# EasyEDA Pro project 25工创PCB.eprj, board 功率板PCB
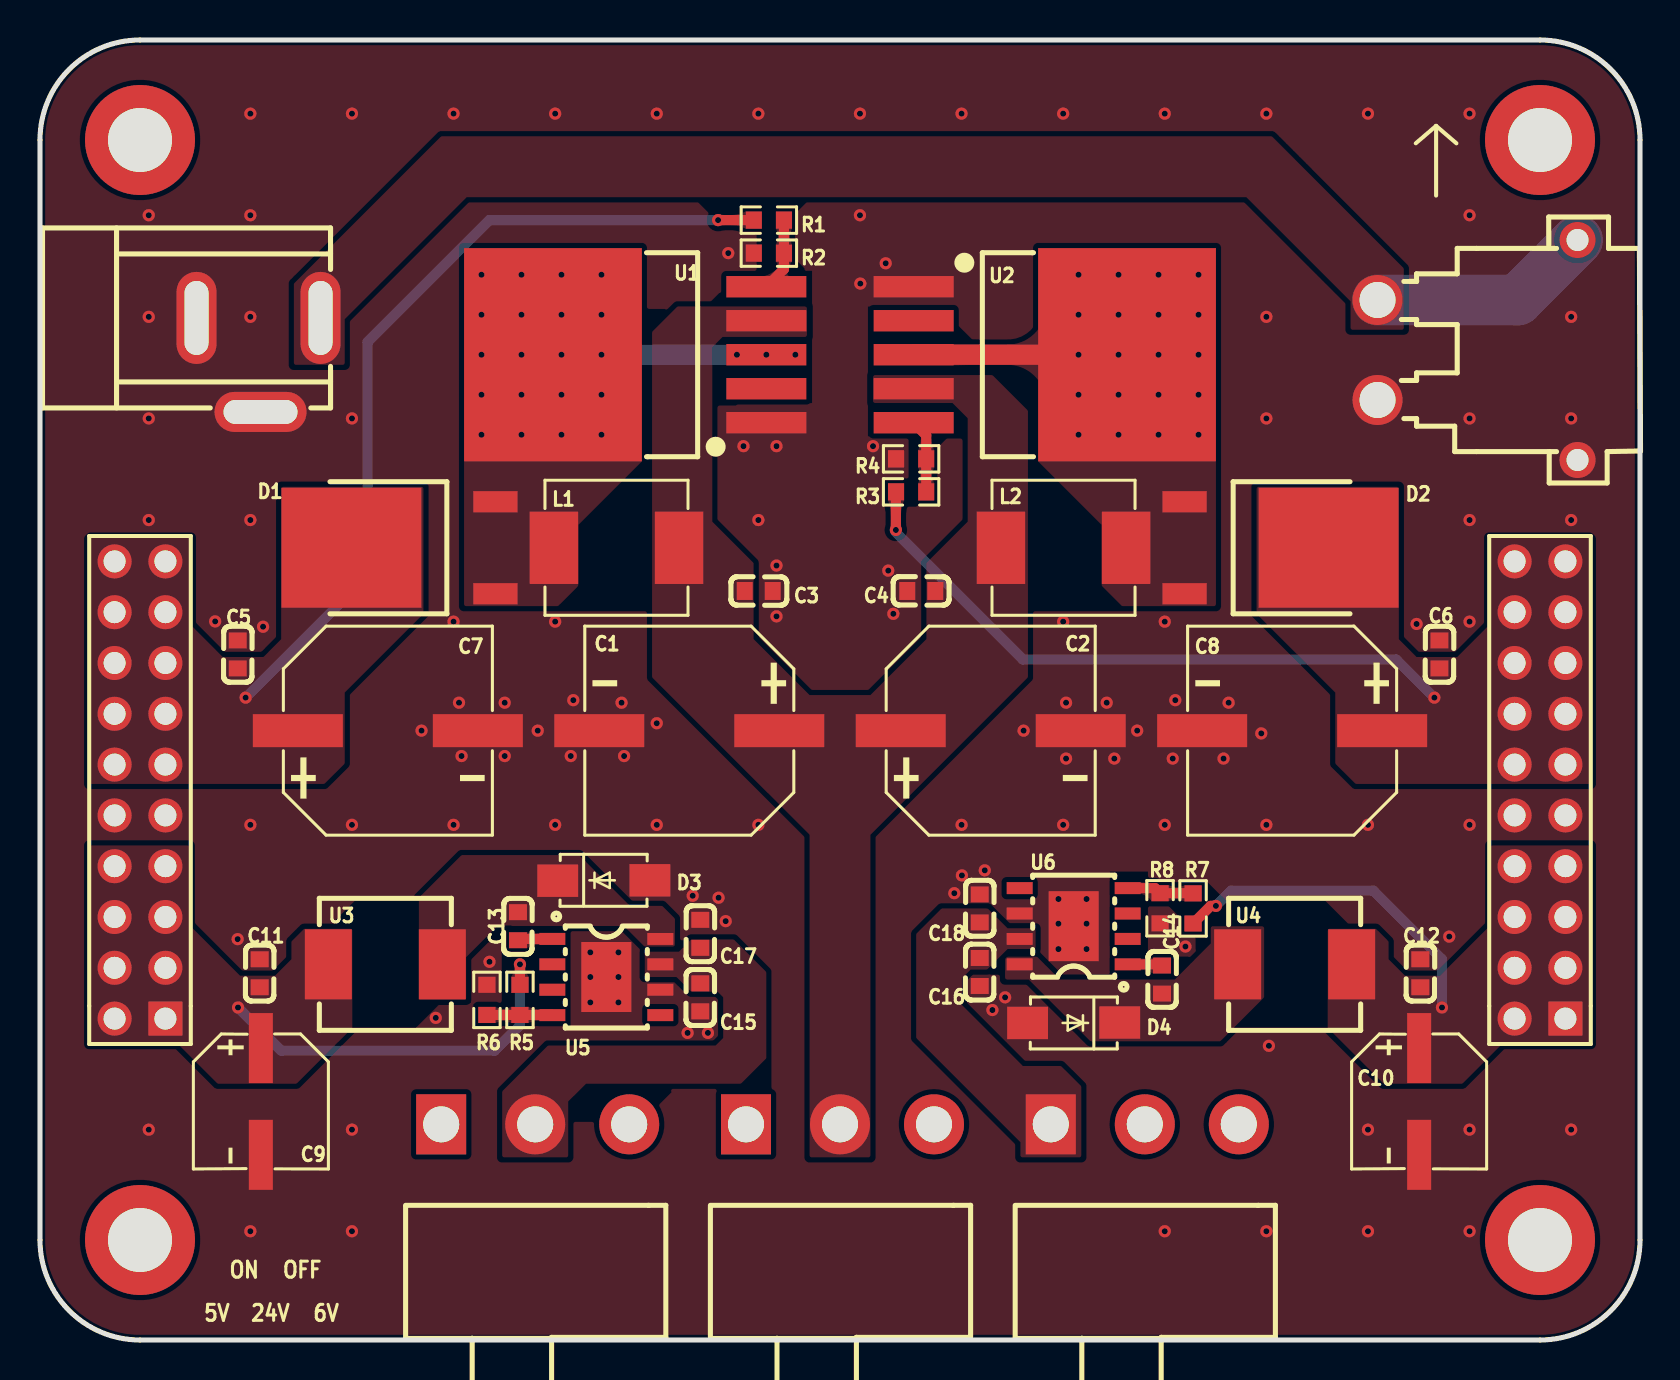
[diagram p8: board, top side]
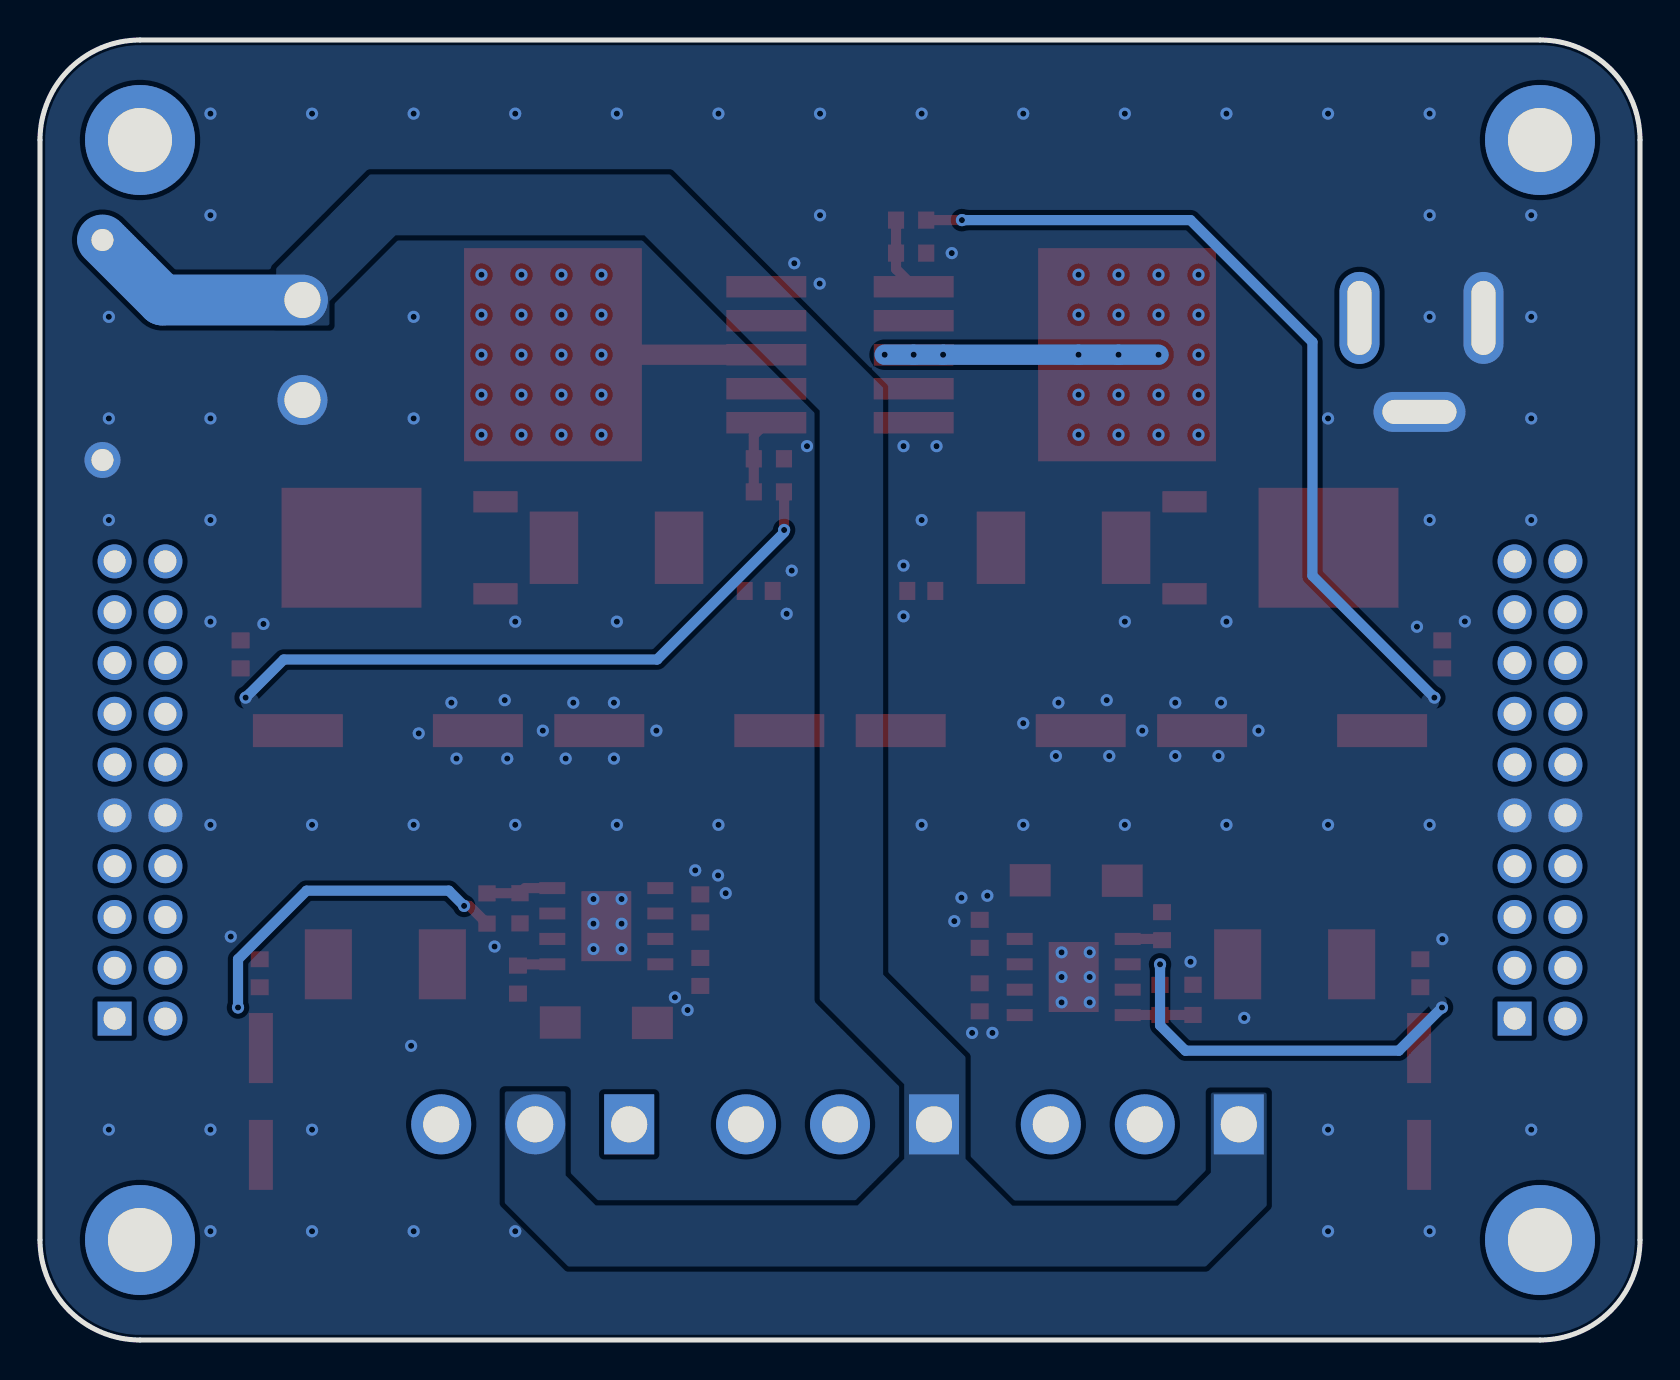
[diagram p9: board, bottom side, seen from below]

Outline 80 x 65 mm; copper layers: Top Layer, Bottom Layer. Coordinates in mm from the lower left corner of the outline.
Outline path: 0,60 0,5 arc(1.46,1.46) 5,0 75,0 arc(78.54,1.46) 80,5 80,60 arc(78.54,63.54) 75,65 5,65 arc(1.46,63.54) 0,60
Stack: Top Layer 0.035mm / Dielectric1 1.51mm FR4 er 4.5 / Bottom Layer 0.035mm

## Design rules (mm)
template: 自定义配置
spacing copperThickness1oz (default): track to track 0.102, other pairs 0.152 to 0.3
spacing copperThickness2oz: track to track 0.203, other pairs 0.152 to 0.3
track width copperThickness1oz (default): min 0.127, default 0.254, max 2.54
track width copperThickness2oz: min 0.203, default 0.254, max 2.54
differential pair differentialPair (default): width min 0.127, default 0.254, max 2.54; gap min 0.152, default 0.152
via viaSize (default): diameter min 0.5, default 0.61, max 10; hole min 0.3, default 0.305, max 6.3

## Placement (name value [footprint] x y rotation side)
C1  680uF  [CAP-SMD_BD10.0-L10.3-W10.3-LS11.3-FD]  32.46 30.47 180 top
C2  680uF  [CAP-SMD_BD10.0-L10.3-W10.3-LS11.3-FD]  47.54 30.47 0 top
C3  1uF  [C0603]  35.94 37.45 180 top
C4  1uF  [C0603]  44.06 37.45 0 top
C5  1uF  [C0603]  9.89 34.28 270 top
C6  1uF  [C0603]  69.97 34.28 270 top
C7  680uF  [CAP-SMD_BD10.0-L10.3-W10.3-LS11.3-FD]  17.39 30.47 0 top
C8  680uF  [CAP-SMD_BD10.0-L10.3-W10.3-LS11.3-FD]  62.61 30.47 180 top
C9  220uF  [CAP-SMD_BD6.3-L6.6-W6.6-FD]  11.04 11.93 270 top
C10  220uF  [CAP-SMD_BD6.3-L6.6-W6.6-FD]  68.96 11.93 270 top
C11  100nF  [C0603]  10.98 18.34 270 top
C12  100nF  [C0603]  69.02 18.34 270 top
C13  10nF  [C0603]  23.9 20.69 90 top
C14  10nF  [C0603]  56.1 18.02 270 top
C15  4.7uF  [C0603]  33.01 17.13 90 top
C16  4.7uF  [C0603]  46.99 18.4 90 top
C17  4.7uF  [C0603]  33.01 20.31 270 top
C18  4.7uF  [C0603]  46.99 21.58 270 top
CN3  XT30PW-M30.G.Y  [CONN-TH_XT30PW-M]  71.88 49.5 90 top
D1  MBRD1045  [TO-252-3_L6.5-W5.9-P4.60-LS10.0-BL]  19.17 39.61 90 top
D2  MBRD1045  [TO-252-3_L6.5-W5.9-P4.60-LS10.0-BL]  60.83 39.61 270 top
D3  SS54  [SMA_L4.3-W2.6-LS5.0-FD]  28.19 22.97 180 top
D4  SS54  [SMA_L4.3-W2.6-LS5.0-FD]  51.68 15.86 0 top
DC2  -  [DC-IN-TH_DC005]  10.93 48.75 0 top
H1  X6521WV-2x10H-C60D30  [HDR-TH_20P-P2.54-V-M-R2-C10-S2.54]  75 27.5 90 top
H2  X6521WV-2x10H-C60D30  [HDR-TH_20P-P2.54-V-M-R2-C10-S2.54]  5 27.5 90 top
L1  47uH  [IND-SMD_L7.0-W6.6_FXL0630]  28.82 39.61 0 top
L2  47uH  [IND-SMD_L7.0-W6.6_FXL0630]  51.18 39.61 180 top
NOREF  -  [Pad_e55]  5 60 0 top
NOREF#2  -  [Pad_e54]  75 60 0 top
NOREF#3  -  [Pad_e57]  75 5 0 top
NOREF#4  -  [Pad_e56]  5 5 0 top
POWER1  SS-12D06L5  [SW-TH_3P-P4.70_L11.1-W12.7]  40 10.78 0 top
POWER2  SS-12D06L5  [SW-TH_3P-P4.70_L11.1-W12.7]  24.76 10.78 0 top
POWER3  SS-12D06L5  [SW-TH_3P-P4.70_L11.1-W12.7]  55.24 10.78 0 top
R1  49.9kΩ  [R0603]  36.44 56 180 top
R2  2.7kΩ  [R0603]  36.44 54.34 0 top
R3  49.9kΩ  [R0603]  43.56 42.41 180 top
R4  2.7kΩ  [R0603]  43.56 44.06 0 top
R5  10KΩ  [R0603]  24 17.01 90 top
R6  3.24KΩ  [R0603]  22.35 17.01 270 top
R7  10KΩ  [R0603]  57.65 21.58 270 top
R8  2.55KΩ  [R0603]  56 21.59 90 top
U1  XL6019E1  [TO-263-5_L10.2-W9.9-P1.70-LS14.4-TL]  30.98 49.26 180 top
U2  XL6019E1  [TO-263-5_L10.2-W9.9-P1.70-LS14.4-TL]  49.02 49.26 0 top
U3  22uH  [IND-SMD_L7.2-W6.6_GPSR07X0]  17.27 18.78 0 top
U4  22uH  [IND-SMD_L7.2-W6.6_GPSR07X0]  62.73 18.78 180 top
U5  TPS5430DDAR  [ESOP-8_L4.9-W3.9-P1.27-LS6.0-TL-EP]  28.32 18.15 0 top
U6  TPS5430DDAR  [ESOP-8_L4.9-W3.9-P1.27-LS6.0-TL-EP]  51.68 20.69 180 top

## Footprints (pads in the part's own frame, mm; a bottom-side part is the same pattern mirrored in y, then rotated)
C0603
  rect 0.8x0.9 smd: 1(-0.7,0) 2(0.7,0)
CAP-SMD_BD6.3-L6.6-W6.6-FD
  rect 3.5x1.2 smd: 1(-2.67,0) 2(2.67,0)
CAP-SMD_BD10.0-L10.3-W10.3-LS11.3-FD
  rect 4.5x1.65 smd: 1(-4.5,0) 2(4.5,0)
CONN-TH_XT30PW-M
  round 2.5 hole 1.8: 1(-2.5,5) 2(2.5,5)
  round 1.8 hole 1.1: 3(5.5,-5) 4(-5.5,-5)
DC-IN-TH_DC005
  oval 2x4.6 hole 1.2x3.7: 1(3.1,2.35) 2(-3.1,2.35)
  oval 4.6x2 hole 3.7x1.2: 3(0.1,-2.35)
ESOP-8_L4.9-W3.9-P1.27-LS6.0-TL-EP
  rect 1.3x0.6 smd: 1(-2.7,1.905) 2(-2.7,0.635) 3(-2.7,-0.635) 4(-2.7,-1.905) 5(2.7,-1.905) 6(2.7,-0.635) 7(2.7,0.635) 8(2.7,1.905)
  rect 2.5x3.5 smd: 9(0,0)
HDR-TH_20P-P2.54-V-M-R2-C10-S2.54
  rect 1.7x1.7 hole 1.1: 1(-11.43,-1.27)
  round 1.7 hole 1.1: 2(-11.43,1.27) 3(-8.89,-1.27) 4(-8.89,1.27) 5(-6.35,-1.27) 6(-6.35,1.27) 7(-3.81,-1.27) 8(-3.81,1.27) 9(-1.27,-1.27) 10(-1.27,1.27) 11(1.27,-1.27) 12(1.27,1.27) 13(3.81,-1.27) 14(3.81,1.27) 15(6.35,-1.27) 16(6.35,1.27) 17(8.89,-1.27) 18(8.89,1.27) 19(11.43,-1.27) 20(11.43,1.27)
IND-SMD_L7.0-W6.6_FXL0630
  rect 2.424x3.62 smd: 1(3.128,0) 2(-3.128,0)
IND-SMD_L7.2-W6.6_GPSR07X0
  rect 2.35x3.5 smd: 1(-2.85,0) 2(2.85,0)
Pad_e54
  round 5.5 hole 3.2: 101(0,0)
Pad_e55
  round 5.5 hole 3.2: 101(0,0)
Pad_e56
  round 5.5 hole 3.2: 101(0,0)
Pad_e57
  round 5.5 hole 3.2: 101(0,0)
R0603
  rect 0.806x0.864 smd: 1(-0.753,0) 2(0.753,0)
SMA_L4.3-W2.6-LS5.0-FD
  rect 2.046x1.62 smd: 1(-2.304,-0.009) 2(2.304,0.009)
SW-TH_3P-P4.70_L11.1-W12.7
  rect 2.5x3 hole 1.8: 1(-4.7,0)
  round 3 hole 1.8: 2(0,0) 3(4.7,0)
TO-252-3_L6.5-W5.9-P4.60-LS10.0-BL
  rect 1.064x2.219 smd: 1(-2.3,-3.599) 3(2.3,-3.599)
  rect 6x7 smd: 2(0,3.599)
TO-263-5_L10.2-W9.9-P1.70-LS14.4-TL
  rect 4x1.069 smd: 1(-5.334,3.4) 2(-5.334,1.7) 3(-5.334,0) 4(-5.334,-1.7) 5(-5.334,-3.4)
  rect 8.89x10.66 smd: 6(5.334,0)

## Nets
As in the schematic.

Pads without a net: NOREF 101; NOREF#2 101; NOREF#3 101; NOREF#4 101; POWER1 3; POWER2 3; POWER3 3; U1 2; U2 2; U5 2 3 5; U6 2 3 5

## Via types
v1: diameter 0.61, hole 0.305, Top Layer to Bottom Layer, 173 vias

## Routing (per net, layer and track width the routed paths; a pad name or vN(x,y) marks a point on that pad's centre or on a via; arc(x,y) is an arc through that point)
24V_1: length 42.1
  Top Layer w0.508: v1(33.9,56) R1.2
  Bottom Layer w0.508: v1(10.28,32.12) 16.38,38.22 16.38,49.9 22.47,56 v1(33.9,56)
24V_2: length 32.3
  Top Layer w0.508: v1(42.79,40.5) 42.79,42.4 R3.2
  Bottom Layer w0.508: 42.79,40.37 49.14,34.02 67.81,34.02 v1(69.72,32.12)
+5V: length 19.6
  Top Layer w0.508: v1(24,18.78) R5.2
  Bottom Layer w0.508: v1(24,18.78) 24,15.74 22.73,14.47 12.06,14.47 v1(9.9,16.62)
+6V: length 17
  Top Layer w0.508: v1(58.8,21.7) 58.53,21.7 R7.2
  Bottom Layer w0.508: v1(58.8,21.7) 59.56,22.47 66.67,22.47 70.1,19.04 v1(70.1,16.62)
GND:
  vias: v1(5.44,56.24) v1(5.44,51.16) v1(5.44,46.08) v1(5.44,41) v1(5.44,10.52) v1(8.76,35.93) v1(9.88,20.04) v1(10.52,61.32) v1(10.52,56.24) v1(10.52,51.16) v1(10.52,41) v1(10.52,25.76) v1(10.52,5.44) v1(11.15,35.66) v1(15.6,61.32) v1(15.6,46.08) v1(15.6,25.76) v1(15.6,10.52) v1(15.6,5.44) v1(19.08,30.47) v1(19.79,16.11) v1(20.68,61.32) v1(20.68,35.92) v1(20.68,25.76) v1(20.95,31.86) v1(21.08,29.2) v1(22.47,18.91) v1(23.24,31.86) v1(23.24,29.2) v1(24.89,30.47) v1(25.76,61.32) v1(25.76,35.92) v1(25.76,25.76) v1(26.54,29.2) v1(26.66,31.99) v1(27.52,19.38) v1(27.52,18.15) v1(27.52,16.88) v1(28.92,19.38) v1(28.92,18.15) v1(28.92,16.88) v1(29.08,31.86) v1(29.21,29.2) v1(30.84,61.32) v1(30.84,30.84) v1(30.84,25.76) v1(32.38,15.36) v1(32.63,22.21) v1(33.4,15.36) v1(33.93,22.11) v1(34.28,20.94) v1(34.41,54.34) v1(35.17,44.69) v1(35.92,61.32) v1(35.92,41) v1(35.92,25.76) v1(36.82,44.69) v1(36.82,38.72) v1(36.82,36.18) v1(41,61.32) v1(41,56.24) v1(41.02,52.82) v1(41.65,44.69) v1(42.29,53.84) v1(42.41,38.47) v1(42.67,36.31) v1(45.72,22.34) v1(46.08,61.32) v1(46.08,25.76) v1(46.1,23.23) v1(47.24,23.48) v1(47.62,16.5) v1(48.25,17.13) v1(49.18,30.47) v1(50.92,22.05) v1(50.92,20.82) v1(50.92,19.55) v1(51.16,61.32) v1(51.16,35.92) v1(51.16,25.76) v1(51.3,31.86) v1(51.3,29.07) v1(52.33,22.05) v1(52.33,20.82) v1(52.33,19.55) v1(53.34,31.86) v1(53.72,29.07) v1(54.86,30.47) v1(56.24,61.32) v1(56.24,35.92) v1(56.24,25.76) v1(56.24,5.44) v1(56.64,29.07) v1(56.76,31.99) v1(57.27,19.67) v1(59.18,29.07) v1(59.43,31.86) v1(61.06,30.33) v1(61.32,61.32) v1(61.32,51.16) v1(61.32,46.08) v1(61.32,25.76) v1(61.32,5.44) v1(61.44,14.71) v1(66.4,61.32) v1(66.4,25.76) v1(66.4,10.52) v1(66.4,5.44) v1(68.83,35.8) v1(70.46,20.17) v1(71.48,61.32) v1(71.48,56.24) v1(71.48,46.08) v1(71.48,41) v1(71.48,35.92) v1(71.48,25.76) v1(71.48,10.52) v1(71.48,5.44) v1(76.56,51.16) v1(76.56,46.08) v1(76.56,41) v1(76.56,10.52)
+POW: length 11.2
  Bottom Layer w2.54: CN3.2 73.88,52 CN3.3
$1N7163: length 13.7
  Bottom Layer w1.016: v1(24.07,49.26) v1(26.07,49.26) v1(28.07,49.26) v1(34.85,49.26) v1(36.32,49.26) v1(37.77,49.26)
  vias: v1(22.07,53.26) v1(22.07,51.26) v1(22.07,49.26) v1(22.07,47.26) v1(22.07,45.26) v1(24.07,53.26) v1(24.07,51.26) v1(24.07,47.26) v1(24.07,45.26) v1(26.07,53.26) v1(26.07,51.26) v1(26.07,47.26) v1(26.07,45.26) v1(28.07,53.26) v1(28.07,51.26) v1(28.07,47.26) v1(28.07,45.26)
$1N7164: length 3.7
  Top Layer w0.508: U1.5 37.2,53.54 R2.2 R1.1
$1N7175: length 3.7
  Top Layer w0.508: R3.1 R4.2 44.31,45.24 U2.5
$1N7176: length 8.2
  Top Layer w1.016: U2.3 v1(51.93,49.26)
  vias: v1(51.93,53.26) v1(51.93,51.26) v1(51.93,47.26) v1(51.93,45.26) v1(53.93,53.26) v1(53.93,51.26) v1(53.93,49.26) v1(53.93,47.26) v1(53.93,45.26) v1(55.93,53.26) v1(55.93,51.26) v1(55.93,49.26) v1(55.93,47.26) v1(55.93,45.26) v1(57.93,53.26) v1(57.93,51.26) v1(57.93,49.26) v1(57.93,47.26) v1(57.93,45.26)
$1N7193: length 3.3
  Top Layer w0.508: U5.4 25.61,16.25 R5.1 R6.2
$1N7197: length 1.7
  Top Layer w0.508: C13.1 23.96,20.05 U5.1
$1N7211: length 3.4
  Top Layer w0.508: U6.4 55.75,22.59 R8.2 57.64,22.34 R7.1
$1N7216: length 1.7
  Top Layer w0.508: C14.1 56.04,18.78 U6.1

## Copper pours and planes (outline as drawn; the poured copper is in the pictures)
24V_1 on Top Layer: 19.17,42.66 19.17,36.31 15.23,32.37 15.23,28.82 14.22,27.8 2.46,27.8 2.46,40.05 2.53,40.12 7.54,40.12 7.54,35.75 9.14,34.15 11.17,34.15 12.06,35.04 12.06,42.66
24V_2 on Top Layer: 60.83,42.66 60.83,36.31 64.76,32.37 64.76,28.82 65.78,27.8 77.54,27.8 77.54,40.05 77.47,40.12 72.46,40.12 72.46,35.75 70.86,34.15 68.83,34.15 67.94,35.04 67.94,42.66
+5V on Top Layer: 15.62,20.56 13.2,20.56 12.57,19.93 12.57,19.04 11.75,18.22 10,18.22 7.49,20.73 7.49,24.72 2.46,24.72 2.46,14.8 6.9,14.8 8.89,12.81 12.82,12.81 15.62,15.61
+6V on Top Layer: 64.38,20.56 66.8,20.56 67.43,19.93 67.43,19.04 68.25,18.22 70,18.22 72.51,20.73 72.51,24.72 77.54,24.72 77.54,14.8 73.1,14.8 71.12,12.81 67.18,12.81 64.38,15.61
GND on Top Layer: -1.78,67.42 81.78,67.42 81.78,-3.31 -1.78,-3.31
GND on Bottom Layer: -5.72,70.85 87.12,70.85 87.12,-7.12 -5.72,-7.12
+POW on Top Layer: 12.69,48.76 12.69,52.82 20.06,60.19 61.59,60.19 68.19,53.58 68.19,50.52 65.53,50.52 65.53,51.93 60.32,57.14 21.33,57.14 15.23,51.04 15.23,48.76
+POW on Bottom Layer: 65.53,51.93 62.22,55.23 49.78,55.23 41.02,46.47 41.02,17.02 36.79,12.79 36.79,9.06 39.12,6.73 52.22,6.73 53.72,8.23 53.72,12.43 56.76,12.43 56.76,6.85 53.59,3.67 21.71,3.67 18.66,6.72 18.66,12.37 21.46,12.37 21.46,8.37 23.11,6.72 31.38,6.72 33.72,9.06 33.72,14.15 37.84,18.27 37.84,47.61 48.51,58.28 63.5,58.28 68.19,53.58 68.19,50.72 65.53,50.72
$1N7163 on Top Layer: 21.2,54.6 21.2,36.69 25.9,36.69 26.92,37.71 26.92,40.75 30.09,43.93 30.09,54.6
$1N7176 on Top Layer: 58.8,54.6 58.8,36.69 54.1,36.69 53.08,37.71 53.08,40.75 49.91,43.93 49.91,54.6
$1N7196 on Top Layer: 30.22,19.67 29.19,20.7 22.87,20.7 21.31,19.14 21.31,17.01 18.94,17.01 18.94,22.11 21.08,24.25 26.96,24.25 29.5,21.7 31.11,21.7 31.75,21.07 31.75,19.67
$1N7209 on Top Layer: 48.25,19.17 48.25,18.02 49.44,18.02 52.52,14.94 59.01,14.94 61.21,17.13 61.21,20.69 58.54,20.69 58.54,19.83 56.74,18.02 51,18.02 49.85,19.17
$1N7218 on Top Layer: 23.11,9.13 23.11,12.43 25.4,14.72 33.78,14.72 34.16,15.1 34.16,17.13 33.88,17.41 32.56,17.41 31.82,18.15 30.24,18.15 30.24,19.42 31.95,19.42 32.56,20.03 34.69,20.03 36.32,18.4 36.32,14.09 35.05,12.81 27.3,12.81 26.41,11.93 26.41,9.13
$1N8312 on Top Layer: 35.68,35.04 38.48,32.25 41.52,32.25 44.32,35.04 44.32,38.85 46.38,40.92 46.38,46.09 45.62,46.85 41.62,46.85 41.62,48.25 47.62,48.25 49.4,46.47 49.4,33.14 41.52,25.26 41.52,9.13 38.48,9.13 38.48,25.26 30.6,33.14 30.6,50.41 31.87,51.68 38.38,51.68 38.38,50.15 34.12,50.15 33.62,49.64 33.62,40.92 35.68,38.85
$1N8365 on Top Layer: 49.02,9.13 49.02,9.89 43.81,15.1 43.81,20.31 45.08,21.58 47.38,21.58 48.38,20.58 49.78,20.58 49.78,19.55 48.38,19.55 47.36,18.52 46.53,18.52 46.1,18.08 46.1,16.75 49.14,13.7 51.05,13.7 52.06,12.69 52.06,9.13

Small or netless copper shapes (teardrops, artwork), in the pictures only: 27 on Top Layer, 6 on Bottom Layer

## Text on the board
Top Silkscreen Layer: 5V | ON | 24V | OFF | 6V | →
